# Altium schematic sheet DEBUG.SchDoc
size 420 x 297 mm; DocumentNumber: 14; SheetNumber: 15; SheetTotal: 17
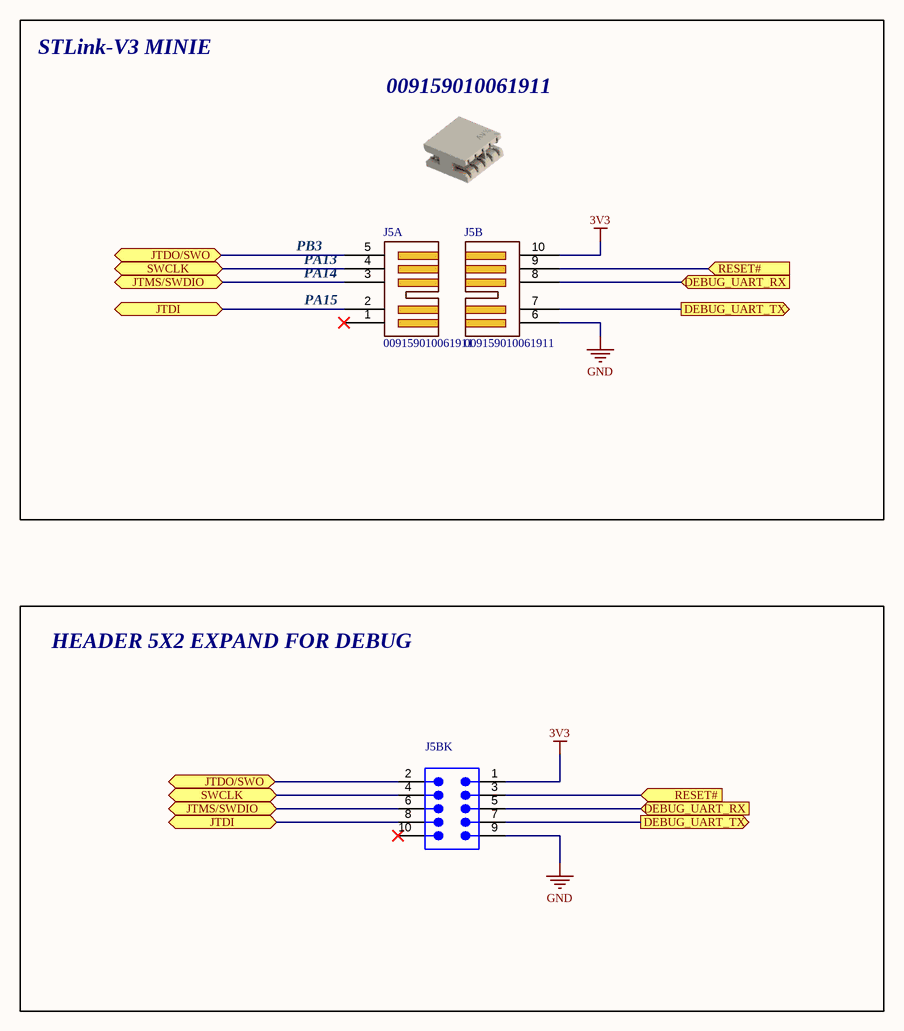
[diagram p0: DEBUG.SchDoc]

## Parts
J5  009159010061911  [009159010061911]  (parts A,B of 2)
J5BK  61301021121  [61301021121]  (value not drawn)

## Blocks framed on the sheet
HEADER 5X2 EXPAND FOR DEBUG: J5BK

## Ports
DEBUG_UART_RX (in), DEBUG_UART_TX (out), JTDI (bidir), JTDO/SWO (bidir), JTMS/SWDIO (bidir), RESET# (in), SWCLK (bidir)

## Nets
3V3: J5.10 J5BK.1
GND: J5.6 J5BK.9
DEBUG_UART_RX: J5.8 J5BK.5 ; port DEBUG_UART_RX
DEBUG_UART_TX: J5.7 J5BK.7 ; port DEBUG_UART_TX
JTDI: J5.2 J5BK.8 ; port JTDI
JTDO/SWO: J5.5 J5BK.2 ; port JTDO/SWO
JTMS/SWDIO: J5.3 J5BK.6 ; port JTMS/SWDIO
RESET#: J5.9 J5BK.3 ; port RESET#
SWCLK: J5.4 J5BK.4 ; port SWCLK

Not connected (* = marked no-connect by the designer): J5 1*; J5BK 10*

## Notes on the sheet
- STLink-V3 MINIE
- 009159010061911
- PB3
- PA13
- PA14
- PA15
- Project:
- BEE-PC1
- Sub-system:
- NANORACK_EXP_CONTROLLER
- Design by:
- SANG HUYNH
- BAO BUI Q.
- Sheet title:
- Sheet
- A3
- of
- Checked by:
- Approved by:
- VU PHAM
- Revision:
- Document No:
- V1.2.2
- Size:
- Date:

## Library data of the parts
J5 = 009159010061911: pads for STLink V3 minie
J5BK = 61301021121: WR-PHD Pin Header, THT, Vertical, pitch 2.54mm, 2 Row, 10P; Manufacturer: Wurth Elektronik; Contact Resistance: 20mOhm; Rated Current: 3A; Working Voltage: 250V; Withstanding Voltage: 500V; Manufacturer Part Number: 61301021121; Category: Board-to-Board Connectors; Match Code: WR-PHD; ComponentLink1Description: Website Link; ComponentLink1URL: https://www.we-online.com/redexpert/article/61301021121?ad; ComponentLink2Description: Datasheet Link; ComponentLink2URL: https://www.we-online.com/redexpert/spec/61301021121?ad; Mount: Through Hole; Operating Temperature Max: 105°C; Operating Temperature Min: -40°C; Packaging: Bag; Gender: Pin Header; Number of Pins: 10; Number of Rows: 2; Orientation: Vertical; Pitch: 2.54mm